# Altium project PCB_Project.PrjPcb
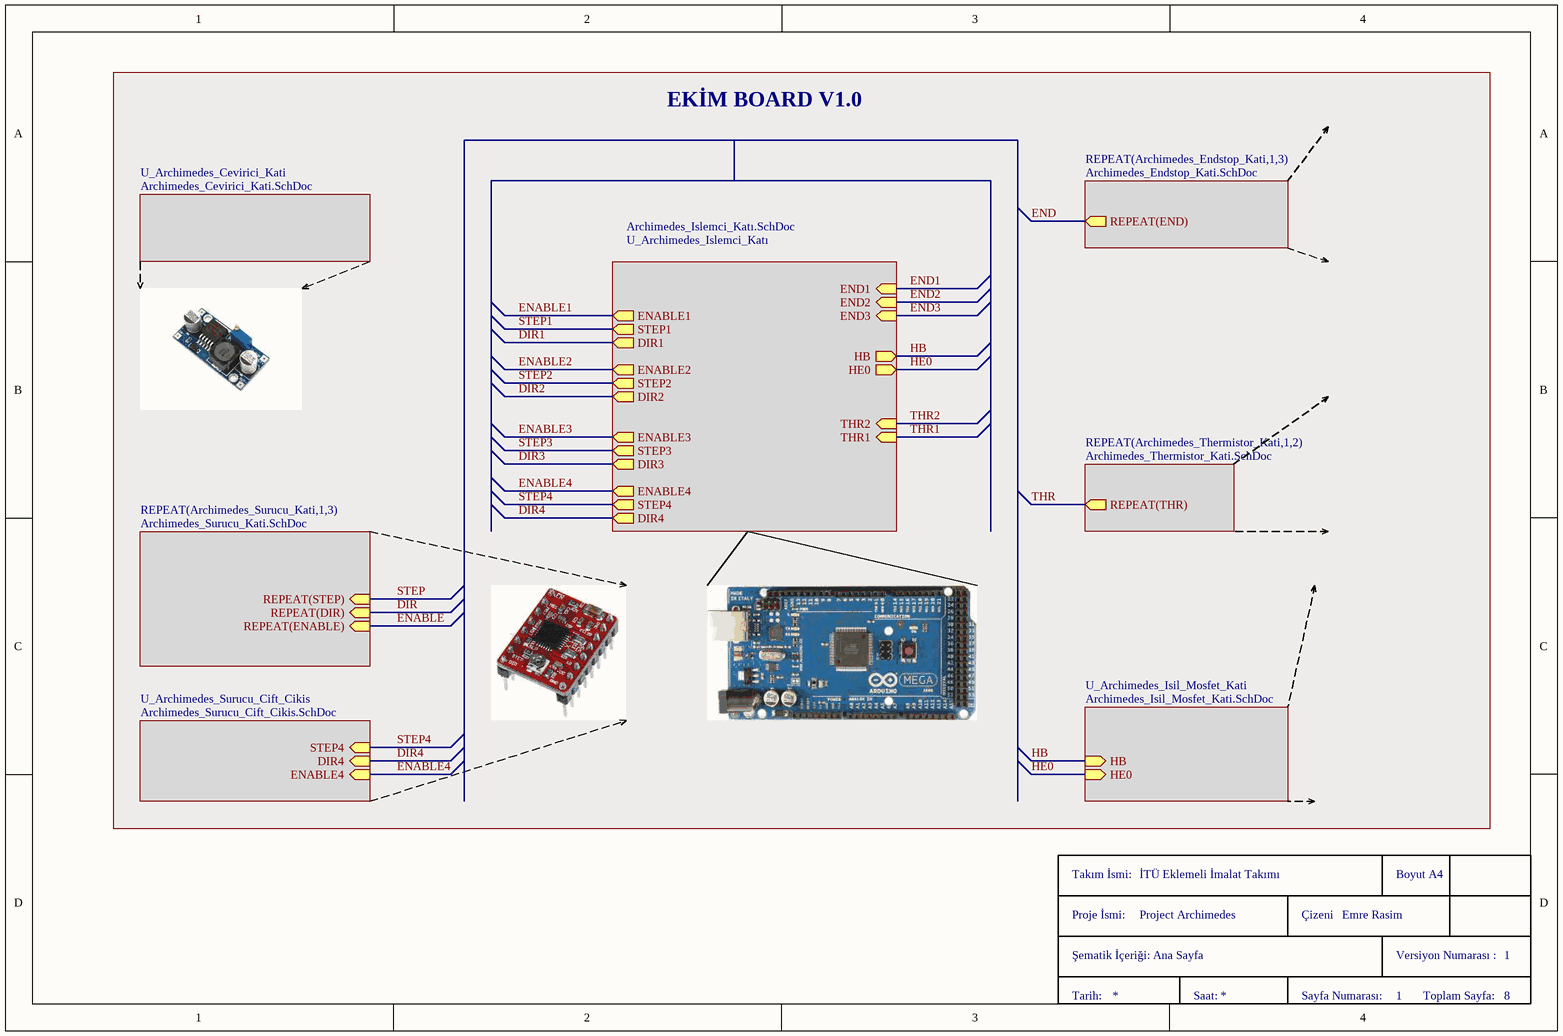
[diagram p0: Archimedes_Ana_Sayfa.SchDoc]
Cizeni: Emre Rasim; Projeismi: Project Archimedes; TakimIsmi: İTÜ Eklemeli İmalat Takımı; Versiyon: 1
8 sheets, 113 parts. Net scope: hierarchical (ports join the sheet entries above them; power ports are global).
Sheets:
  Archimedes_Ana_Sayfa.SchDoc
    U_Archimedes_Islemci_Katı = Archimedes_Islemci_Katı.SchDoc
    Archimedes_Surucu_Kati1 = Archimedes_Surucu_Kati.SchDoc
    Archimedes_Surucu_Kati2 = Archimedes_Surucu_Kati.SchDoc
    Archimedes_Surucu_Kati3 = Archimedes_Surucu_Kati.SchDoc
    Archimedes_Thermistor_Kati1 = Archimedes_Thermistor_Kati.SchDoc
    Archimedes_Thermistor_Kati2 = Archimedes_Thermistor_Kati.SchDoc
    U_Archimedes_Isil_Mosfet_Kati = Archimedes_Isil_Mosfet_Kati.SchDoc
    U_Archimedes_Cevirici_Kati = Archimedes_Cevirici_Kati.SchDoc
    Archimedes_Endstop_Kati1 = Archimedes_Endstop_Kati.SchDoc
    Archimedes_Endstop_Kati2 = Archimedes_Endstop_Kati.SchDoc
    Archimedes_Endstop_Kati3 = Archimedes_Endstop_Kati.SchDoc
    U_Archimedes_Surucu_Cift_Cikis = Archimedes_Surucu_Cift_Cikis.SchDoc

## Sheet Archimedes_Ana_Sayfa.SchDoc: Ana Sayfa
size A4; DrawnBy: Emre Rasim; DocumentNumber: 4; Revision: 1.0; SheetNumber: 1; SheetTotal: 8; Takimismi: İTÜ Eklemeli İmalat Takımı; Projeismi: Project Archimedes; Sematikicerigi: Ana Sayfa; Versiyon: 1; Cizeni: Emre Rasim

### Parts
(Parts that share a designator on the sheet are numbered #1, #2 ... from top to bottom, then left to right.)
TitleBlock-A4#1  TitleBlock-A4  (value not drawn)  (graphical)

### Sub-sheets
REPEAT(Archimedes_Endstop_Kati,1,3) = Archimedes_Endstop_Kati.SchDoc: REPEAT(END) (out)
REPEAT(Archimedes_Surucu_Kati,1,3) = Archimedes_Surucu_Kati.SchDoc: REPEAT(DIR) (in), REPEAT(STEP) (in), REPEAT(ENABLE) (in)
REPEAT(Archimedes_Thermistor_Kati,1,2) = Archimedes_Thermistor_Kati.SchDoc: REPEAT(THR) (out)
U_Archimedes_Cevirici_Kati = Archimedes_Cevirici_Kati.SchDoc: no entries
U_Archimedes_Isil_Mosfet_Kati = Archimedes_Isil_Mosfet_Kati.SchDoc: HB (in), HE0 (in)
U_Archimedes_Islemci_Katı = Archimedes_Islemci_Katı.SchDoc: ENABLE4 (out), STEP4 (out), DIR4 (out), ENABLE1 (out), STEP3 (out), DIR3 (out), END2 (in), END3 (in), END1 (in), HB (out), HE0 (out), THR2 (in), THR1 (in), ENABLE3 (out), DIR2 (out), STEP2 (out), ENABLE2 (out), DIR1 (out), STEP1 (out)
U_Archimedes_Surucu_Cift_Cikis = Archimedes_Surucu_Cift_Cikis.SchDoc: DIR4 (in), STEP4 (in), ENABLE4 (in)

### Nets
DIR: sheet REPEAT(Archimedes_Surucu_Kati,1,3)/REPEAT(DIR)
DIR4: sheet U_Archimedes_Islemci_Katı/DIR4, sheet U_Archimedes_Surucu_Cift_Cikis/DIR4
ENABLE: sheet REPEAT(Archimedes_Surucu_Kati,1,3)/REPEAT(ENABLE)
ENABLE4: sheet U_Archimedes_Islemci_Katı/ENABLE4, sheet U_Archimedes_Surucu_Cift_Cikis/ENABLE4
END: sheet REPEAT(Archimedes_Endstop_Kati,1,3)/REPEAT(END)
HB: sheet U_Archimedes_Islemci_Katı/HB, sheet U_Archimedes_Isil_Mosfet_Kati/HB
HE0: sheet U_Archimedes_Islemci_Katı/HE0, sheet U_Archimedes_Isil_Mosfet_Kati/HE0
STEP: sheet REPEAT(Archimedes_Surucu_Kati,1,3)/REPEAT(STEP)
STEP4: sheet U_Archimedes_Islemci_Katı/STEP4, sheet U_Archimedes_Surucu_Cift_Cikis/STEP4
THR: sheet REPEAT(Archimedes_Thermistor_Kati,1,2)/REPEAT(THR)

### Notes on the sheet
- EKİM BOARD V1.0
- (in symbol TitleBlock-A4) Takım İsmi:; Boyut A4; Proje İsmi:; Çizeni; Şematik İçeriği:; Versiyon Numarası :; Tarih:; Saat:; Sayfa Numarası:; Toplam Sayfa:

### Library data of the parts
TitleBlock-A4#1 = TitleBlock-A4: Title Block for İTU eklemeli imalat takımı

## Sheet Archimedes_Islemci_Katı.SchDoc: Kontrolcü Katı Tasarımı
size A4; DrawnBy: Emre Rasim; DocumentNumber: 8; Revision: 1.0; SheetNumber: 2; SheetTotal: 8; Sematikicerigi: Kontrolcü Katı Tasarımı
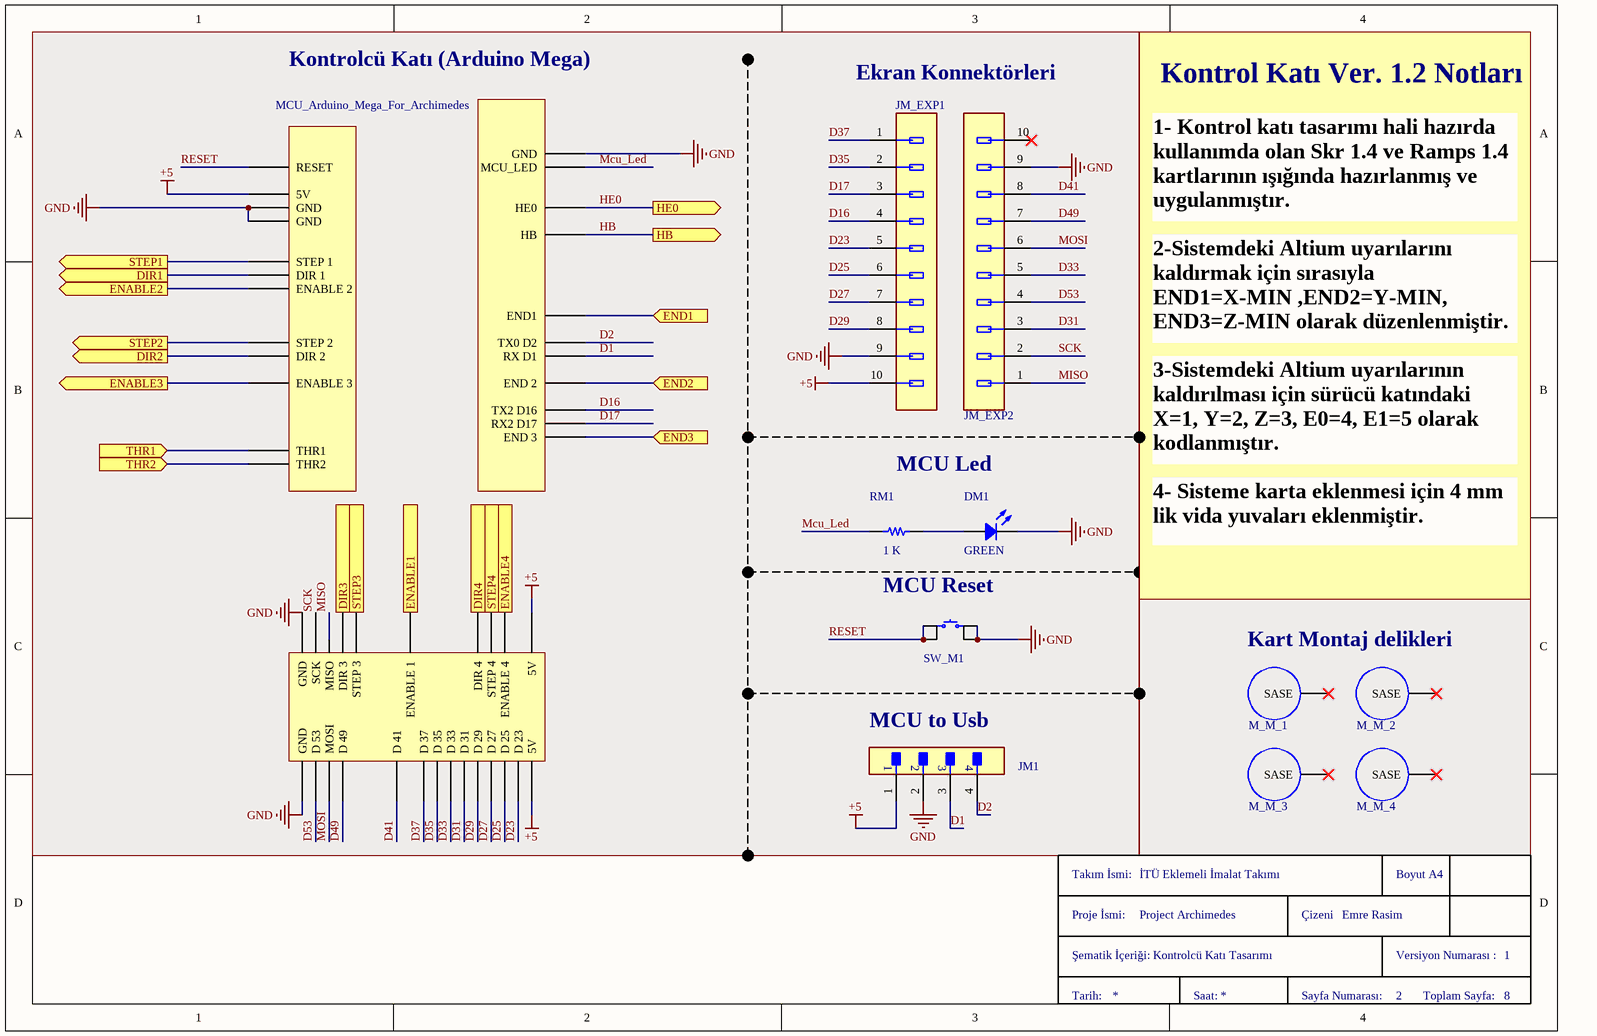
[diagram p1: Archimedes_Islemci_Katı.SchDoc]

### Parts
(Parts that share a designator on the sheet are numbered #1, #2 ... from top to bottom, then left to right.)
DM1  GREEN  [LED 0805/2012 GREEN]
JM1  2.5 mm locked  [CON_2.5MM_4_LEAD_180_LOCKED]  (value not drawn)
JM_EXP1  Con_2.54mm_10 lead_2 row_Ipc connector  [Con_10pin_2row_ıpc_connector]  (value not drawn)
JM_EXP2  Con_2.54mm_10 lead_2 row_Ipc connector  [Con_10pin_2row_ıpc_connector]  (value not drawn)
M_M_1  Vida  [Montaj4mm]  (value not drawn)
M_M_2  Vida  [Montaj4mm]  (value not drawn)
M_M_3  Vida  [Montaj4mm]  (value not drawn)
M_M_4  Vida  [Montaj4mm]  (value not drawn)
MCU_Arduino_Mega_For_Archimedes  Arduino Mega 2560  [MCU_Arduino_MEGA for Archimedes]  (value not drawn)
RM1  1 K  [RES 0805/2012]
SW_M1  Push button with 6x6 landmark  [SW_PUSH_6X6mm]  (value not drawn)
TitleBlock-A4#2  TitleBlock-A4  (value not drawn)  (graphical)

### Blocks framed on the sheet
Kart Montaj delikleri: M_M_1-M_M_4

### Ports
DIR1 (out), DIR2 (out), DIR3 (out), DIR4 (out), ENABLE1 (out), ENABLE2 (out), ENABLE3 (out), ENABLE4 (out), END1 (in), END2 (in), END3 (in), HB (out), HE0 (out), STEP1 (out), STEP2 (out), STEP3 (out), STEP4 (out), THR1 (in), THR2 (in)

### Nets
+5: JM1.1 JM_EXP1.10 MCU_Arduino_Mega_For_Archimedes.1(5V) MCU_Arduino_Mega_For_Archimedes.2(5V) MCU_Arduino_Mega_For_Archimedes.56(5V)
GND: DM1.2 JM1.2 JM_EXP1.9 JM_EXP2.9 MCU_Arduino_Mega_For_Archimedes.35(GND) MCU_Arduino_Mega_For_Archimedes.36(GND) MCU_Arduino_Mega_For_Archimedes.54(GND) MCU_Arduino_Mega_For_Archimedes.55(GND) MCU_Arduino_Mega_For_Archimedes.83(GND) SW_M1.3 SW_M1.4
D1: JM1.3 MCU_Arduino_Mega_For_Archimedes.69(RX_D1)
D2: JM1.4 MCU_Arduino_Mega_For_Archimedes.70(TX0_D2)
D16: JM_EXP1.4 MCU_Arduino_Mega_For_Archimedes.66(TX2_D16)
D17: JM_EXP1.3 MCU_Arduino_Mega_For_Archimedes.65(RX2_D17)
D23: JM_EXP1.5 MCU_Arduino_Mega_For_Archimedes.4(D_23)
D25: JM_EXP1.6 MCU_Arduino_Mega_For_Archimedes.6(D_25)
D27: JM_EXP1.7 MCU_Arduino_Mega_For_Archimedes.8(D_27)
D29: JM_EXP1.8 MCU_Arduino_Mega_For_Archimedes.10(D_29)
D31: JM_EXP2.3 MCU_Arduino_Mega_For_Archimedes.12(D_31)
D33: JM_EXP2.5 MCU_Arduino_Mega_For_Archimedes.14(D_33)
D35: JM_EXP1.2 MCU_Arduino_Mega_For_Archimedes.16(D_35)
D37: JM_EXP1.1 MCU_Arduino_Mega_For_Archimedes.18(D_37)
D41: JM_EXP2.8 MCU_Arduino_Mega_For_Archimedes.22(D_41)
D49: JM_EXP2.7 MCU_Arduino_Mega_For_Archimedes.30(D_49)
D53: JM_EXP2.4 MCU_Arduino_Mega_For_Archimedes.34(D_53)
DIR1: MCU_Arduino_Mega_For_Archimedes.51(DIR_1) ; port DIR1
DIR2: MCU_Arduino_Mega_For_Archimedes.45(DIR_2) ; port DIR2
DIR3: MCU_Arduino_Mega_For_Archimedes.29(DIR_3) ; port DIR3
DIR4: MCU_Arduino_Mega_For_Archimedes.9(DIR_4) ; port DIR4
ENABLE1: MCU_Arduino_Mega_For_Archimedes.19(ENABLE_1) ; port ENABLE1
ENABLE2: MCU_Arduino_Mega_For_Archimedes.50(ENABLE_2) ; port ENABLE2
ENABLE3: MCU_Arduino_Mega_For_Archimedes.44(ENABLE_3) ; port ENABLE3
ENABLE4: MCU_Arduino_Mega_For_Archimedes.5(ENABLE_4) ; port ENABLE4
END1: MCU_Arduino_Mega_For_Archimedes.72(END1) ; port END1
END2: MCU_Arduino_Mega_For_Archimedes.68(END_2) ; port END2
END3: MCU_Arduino_Mega_For_Archimedes.64(END_3) ; port END3
HB: MCU_Arduino_Mega_For_Archimedes.77(HB) ; port HB
HE0: MCU_Arduino_Mega_For_Archimedes.79(HE0) ; port HE0
Mcu_Led: MCU_Arduino_Mega_For_Archimedes.82(MCU_LED) RM1.1
MISO: JM_EXP2.1 MCU_Arduino_Mega_For_Archimedes.31(MISO)
MOSI: JM_EXP2.6 MCU_Arduino_Mega_For_Archimedes.32(MOSI)
RESET: MCU_Arduino_Mega_For_Archimedes.58(RESET) SW_M1.1 SW_M1.2
SCK: JM_EXP2.2 MCU_Arduino_Mega_For_Archimedes.33(SCK)
STEP1: MCU_Arduino_Mega_For_Archimedes.52(STEP_1) ; port STEP1
STEP2: MCU_Arduino_Mega_For_Archimedes.46(STEP_2) ; port STEP2
STEP3: MCU_Arduino_Mega_For_Archimedes.27(STEP_3) ; port STEP3
STEP4: MCU_Arduino_Mega_For_Archimedes.7(STEP_4) ; port STEP4
THR1: MCU_Arduino_Mega_For_Archimedes.39(THR1) ; port THR1
THR2: MCU_Arduino_Mega_For_Archimedes.38(THR2) ; port THR2
NetDM1_1: DM1.1 RM1.2

Not connected (* = marked no-connect by the designer): JM_EXP2 10*; M_M_1 1(SASE)*; M_M_2 1(SASE)*; M_M_3 1(SASE)*; M_M_4 1(SASE)*

### Notes on the sheet
- Kontrolcü Katı (Arduino Mega)
- Ekran Konnektörleri
- Kontrol Katı Ver. 1.2 Notları
- 1- Kontrol katı tasarımı hali hazırda kullanımda olan Skr 1.4 ve Ramps 1.4 kartlarının ışığında hazırlanmış ve uygulanmıştır.
- 2-Sistemdeki Altium uyarılarını kaldırmak için sırasıyla END1=X-MIN ,END2=Y-MIN, END3=Z-MIN olarak düzenlenmiştir.
- MCU Led
- 3-Sistemdeki Altium uyarılarının kaldırılması için sürücü katındaki X=1, Y=2, Z=3, E0=4, E1=5 olarak kodlanmıştır.
- 4- Sisteme karta eklenmesi için 4 mm lik vida yuvaları eklenmiştir.
- MCU Reset
- (near JM1) MCU to Usb
- (in symbol TitleBlock-A4) Takım İsmi:; Boyut A4; Proje İsmi:; Çizeni; Şematik İçeriği:; Versiyon Numarası :; Tarih:; Saat:; Sayfa Numarası:; Toplam Sayfa:

### Library data of the parts
DM1 = LED 805
JM1 = Con_2.5mm_4_lead_180_locked: 2.5 mm 4 lead locked connector
JM_EXP1 JM_EXP2 = Con_2.54mm_10 lead_2 row_Ipc connector: CONN 10 Positions Header Connector 0.100" (2.54mm) Through Hole Gold; Manufacturer: Molex; Part Number: 70246-1001; Voltage: 250V; Current - Maximum per Contact: 2.5A; Number of Circuits: 10; helpURL: https://upverter.com/upn/revision/723849a355ae3f31/; ComponentLink2Description: Datasheet; Temperature: -55°C to +120°C; Package: HDR10; Supplier 2: Mouser; Supplier 1: Digi-Key; ComponentLink1URL: https://upverter.com/upn/revision/723849a355ae3f31/; Supplier Part Number 2: 538-70246-1001; Supplier Part Number 1: WM9219-ND; ComponentLink1Description: Upverter; ComponentLink2URL: http://www.molex.com/pdm_docs/sd/702461001_sd.pdf; RoHS: TRUE; Mouser Part Number: 538-70246-1001; Temperature Range High: +120°C; Digikey Description: CONN 10 Positions Header Connector 0.100" (2.54mm) Through Hole Gold; Digikey Part Number: WM9219-ND; Lead Free: yes; Temperature Range Low: -55°C; Pitch: 2.54mm
M_M_1-M_M_4 = Montaj Deliği 4mm
MCU_Arduino_Mega_For_Archimedes = MCU_Arduino_Mega_For_Archimedes
RM1 = Resistor 805
SW_M1 = SW_PUSH_6X6mm
TitleBlock-A4#2 = TitleBlock-A4: as TitleBlock-A4#1 on sheet Archimedes_Ana_Sayfa

## Sheet Archimedes_Surucu_Kati.SchDoc: Step Motor Sürücü Katı Tasarımı
size A4; DrawnBy: Emre Rasim; DocumentNumber: 6; Revision: 1.0; SheetNumber: 3; SheetTotal: 7; Sematikicerigi: Step Motor Sürücü Katı Tasarımı
Used 3 times, as channels Archimedes_Surucu_Kati1, Archimedes_Surucu_Kati2, Archimedes_Surucu_Kati3. Parts and nets are listed once, with the designators drawn on the sheet.
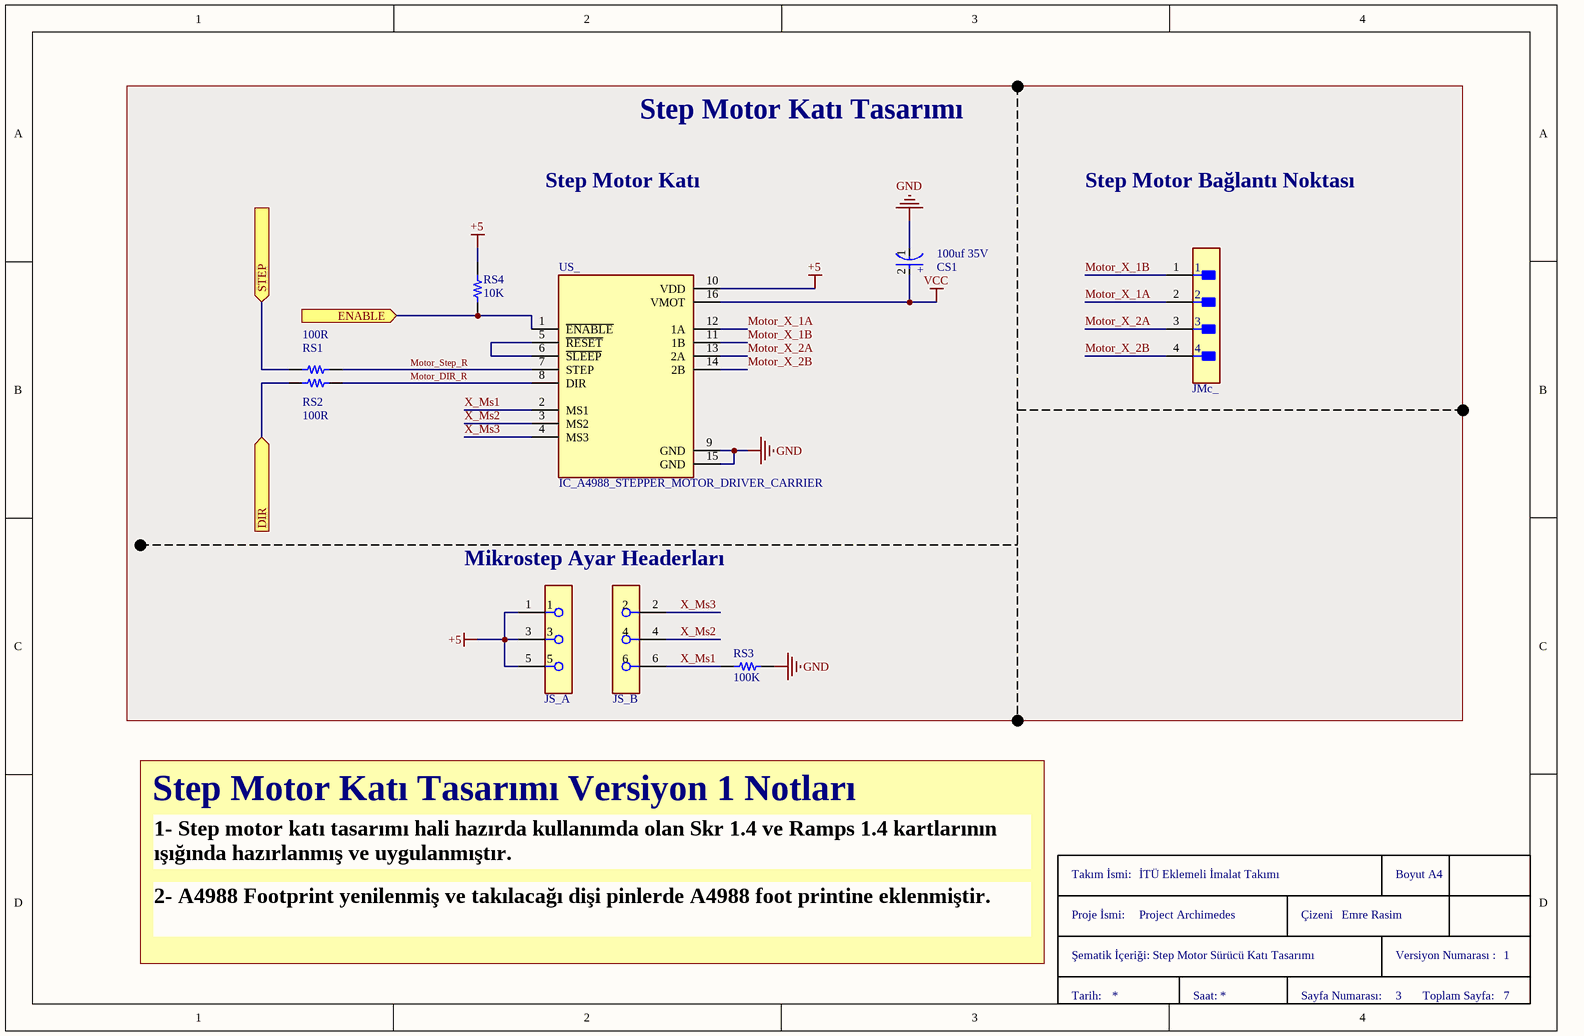
[diagram p2: Archimedes_Surucu_Kati.SchDoc]

### Parts
CS1  100uf 35V  [C_Smd_D6.3_H_7.7_Electrolytic_Cap]
JMc_  2.5 mm locked  [CON_2.5MM_4_LEAD_180_LOCKED]  (value not drawn)
JS_  Con_3*2_Male_Header  [Con_3*2_Male_header]  (value not drawn)  (parts A,B of 2)
RS1  100R  [RES 0805/2012]
RS2  100R  [RES 0805/2012]
RS3  100K  [RES 0805/2012]
RS4  10K  [RES 0805/2012]
TitleBlock-A4  TitleBlock-A4  (value not drawn)  (graphical)
US_  IC_A4988_STEPPER_MOTOR_DRIVER_CARRIER  [IC_A4988_STEPPER_MOTOR_DRIVER_CARRIER]

### Blocks framed on the sheet
Step Motor Katı Tasarımı: CS1 JMc_ JS_ RS1-RS4 US_

### Ports
DIR (in), ENABLE (in), STEP (in)

### Nets
+5: JS_.1 JS_.3 JS_.5 RS4.2 US_.10(VDD)
GND: CS1.1(C) RS3.2 US_.9(GND) US_.15(GND)
VCC: CS1.2(A) US_.16(VMOT)
DIR: RS2.1 ; port DIR
ENABLE: RS4.1 US_.1(~{ENABLE}) ; port ENABLE
Motor_DIR_R: RS2.2 US_.8(DIR)
Motor_Step_R: RS1.2 US_.7(STEP)
Motor_X_1A: JMc_.2 US_.12(1A)
Motor_X_1B: JMc_.1 US_.11(1B)
Motor_X_2A: JMc_.3 US_.13(2A)
Motor_X_2B: JMc_.4 US_.14(2B)
STEP: RS1.1 ; port STEP
X_Ms1: JS_.6 RS3.1 US_.2(MS1)
X_Ms2: JS_.4 US_.3(MS2)
X_Ms3: JS_.2 US_.4(MS3)
NetUS__5: US_.5(~{RESET}) US_.6(~{SLEEP})

### Channels
Archimedes_Surucu_Kati1: designators CS1=CS1A JMc_=JMc_A JS_=JS_A RS1=RS1A RS2=RS2A RS3=RS3A RS4=RS4A TitleBlock-A4=TitleBlock-A4A#1 US_=US_A; ports DIR=DIR1 ENABLE=ENABLE1 STEP=STEP1
Archimedes_Surucu_Kati2: designators CS1=CS1B JMc_=JMc_B JS_=JS_B RS1=RS1B RS2=RS2B RS3=RS3B RS4=RS4B TitleBlock-A4=TitleBlock-A4B#1 US_=US_B; ports DIR=DIR2 ENABLE=ENABLE2 STEP=STEP2
Archimedes_Surucu_Kati3: designators CS1=CS1C JMc_=JMc_C JS_=JS_C RS1=RS1C RS2=RS2C RS3=RS3C RS4=RS4C TitleBlock-A4=TitleBlock-A4C#1 US_=US_C; ports DIR=DIR3 ENABLE=ENABLE3 STEP=STEP3

### Notes on the sheet
- Step Motor Katı
- Step Motor Bağlantı Noktası
- (near JS_) Mikrostep Ayar Headerları
- Step Motor Katı Tasarımı Versiyon 1 Notları
- 1- Step motor katı tasarımı hali hazırda kullanımda olan Skr 1.4 ve Ramps 1.4 kartlarının ışığında hazırlanmış ve uygulanmıştır.
- 2- A4988 Footprint yenilenmiş ve takılacağı dişi pinlerde A4988 foot printine eklenmiştir.
- (in symbol C_smd_D6.3_H7.7) +
- (in symbol TitleBlock-A4) Takım İsmi:; Boyut A4; Proje İsmi:; Çizeni; Şematik İçeriği:; Versiyon Numarası :; Tarih:; Saat:; Sayfa Numarası:; Toplam Sayfa:

### Library data of the parts
CS1 = C_smd_D6.3_H7.7: electrolytic capacitor with 100 uf and 35 volt rating
JMc_ = Con_2.5mm_4_lead_180_locked: 2.5 mm 4 lead locked connector
JS_ = Con_3*2_Male_Header: 3*2 male header
RS1 RS2 = Resistor 805: 100 R ohm Resistor  with 805 pack and %1 tolerance rating
RS3 = Resistor 805: 100 K ohm Resistor  with 805 pack and %1 tolerance rating
RS4 = Resistor 805: 10 K ohm Resistor  with 805 pack and %1 tolerance rating
TitleBlock-A4 = TitleBlock-A4: as TitleBlock-A4#1 on sheet Archimedes_Ana_Sayfa
US_ = IC_A4988_STEPPER_MOTOR_DRIVER_CARRIER: Stepper motor controler; IC: A4988; 1A; Uin mot: 8Ã·35V; Package: None; Availability: Unavailable; Value: *; MP: A4988_STEPPER_MOTOR_DRIVER_CARRIER; Price: None

## Sheet Archimedes_Thermistor_Kati.SchDoc: Thermistör Katı Tasarımı
size A4; DrawnBy: Emre Rasim; DocumentNumber: 5; Revision: 1.0; SheetNumber: 7; SheetTotal: 7; Sematikicerigi: Thermistör Katı Tasarımı
Used 2 times, as channels Archimedes_Thermistor_Kati1, Archimedes_Thermistor_Kati2. Parts and nets are listed once, with the designators drawn on the sheet.
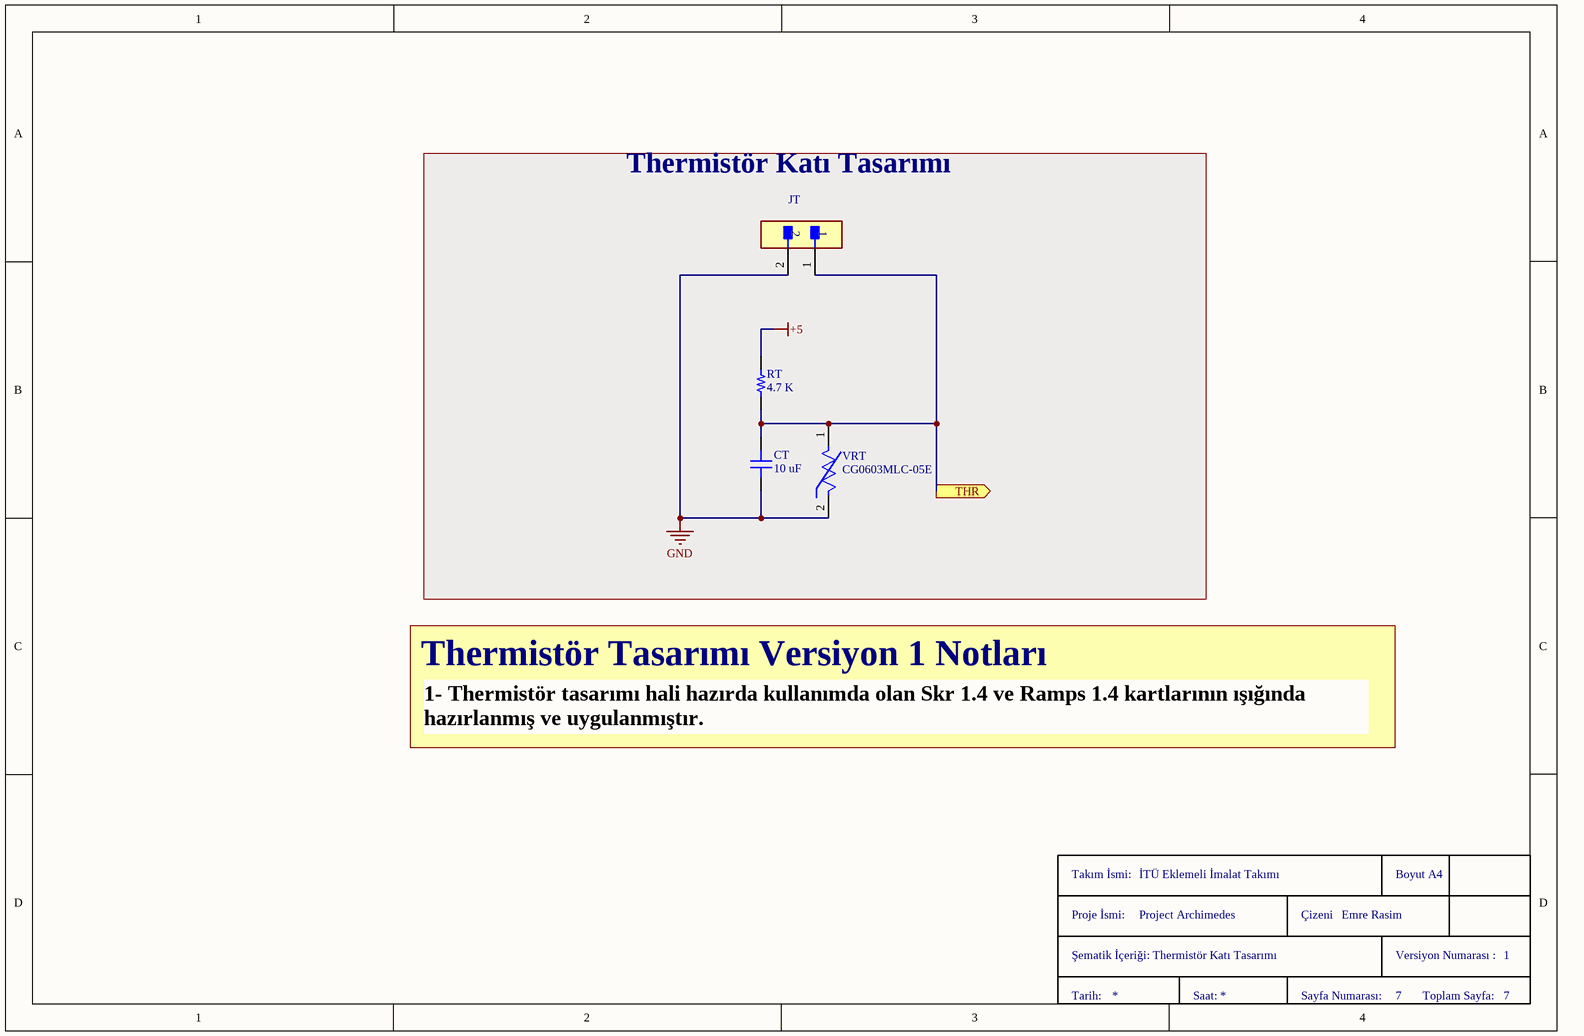
[diagram p3: Archimedes_Thermistor_Kati.SchDoc]

### Parts
CT  10 uF  [CAP 1206/3216]
JT  Con_2.5mm_2 lead_Female locked connector for 3d printer  [Con_2lead_2.5mm_3d_printer]  (value not drawn)
RT  4.7 K  [RES 0805/2012]
TitleBlock-A4  TitleBlock-A4  (value not drawn)  (graphical)
VRT  CG0603MLC-05E  [VR_Varistor_0603_CG0603MLC-05E]

### Blocks framed on the sheet
Thermistör Katı Tasarımı: CT JT RT VRT

### Ports
THR (out)

### Nets
+5: RT.2
GND: CT.1 JT.2 VRT.2
THR: CT.2 JT.1 RT.1 VRT.1 ; port THR

### Channels
Archimedes_Thermistor_Kati1: designators CT=CTA JT=JTA RT=RTA TitleBlock-A4=TitleBlock-A4A#2 VRT=VRTA; ports THR=THR1
Archimedes_Thermistor_Kati2: designators CT=CTB JT=JTB RT=RTB TitleBlock-A4=TitleBlock-A4B#2 VRT=VRTB; ports THR=THR2

### Notes on the sheet
- Thermistör Tasarımı Versiyon 1 Notları
- 1- Thermistör tasarımı hali hazırda kullanımda olan Skr 1.4 ve Ramps 1.4 kartlarının ışığında hazırlanmış ve uygulanmıştır.
- (in symbol TitleBlock-A4) Takım İsmi:; Boyut A4; Proje İsmi:; Çizeni; Şematik İçeriği:; Versiyon Numarası :; Tarih:; Saat:; Sayfa Numarası:; Toplam Sayfa:

### Library data of the parts
CT = Capacitor 1206: 10 uF  and 50 Volt Ceramic Capacitor 1206 pack with X5R rating
RT = Resistor 805: 4.7 K ohm Resistor  with 805 pack and %1 tolerance rating
TitleBlock-A4 = TitleBlock-A4: as TitleBlock-A4#1 on sheet Archimedes_Ana_Sayfa
VRT = VR_0603_CG0603MLC-05E: Varistor with 5v voltage and 0603 package - CG0603MLC-05E

## Sheet Archimedes_Isil_Mosfet_Kati.SchDoc: Isıl - Mosfet Sürücü Katı Tasarımı
size A4; DrawnBy: Emre Rasim; DocumentNumber: 7; Revision: 1.1; SheetNumber: 4; SheetTotal: 8; Sematikicerigi: Isıl - Mosfet Sürücü Katı Tasarımı
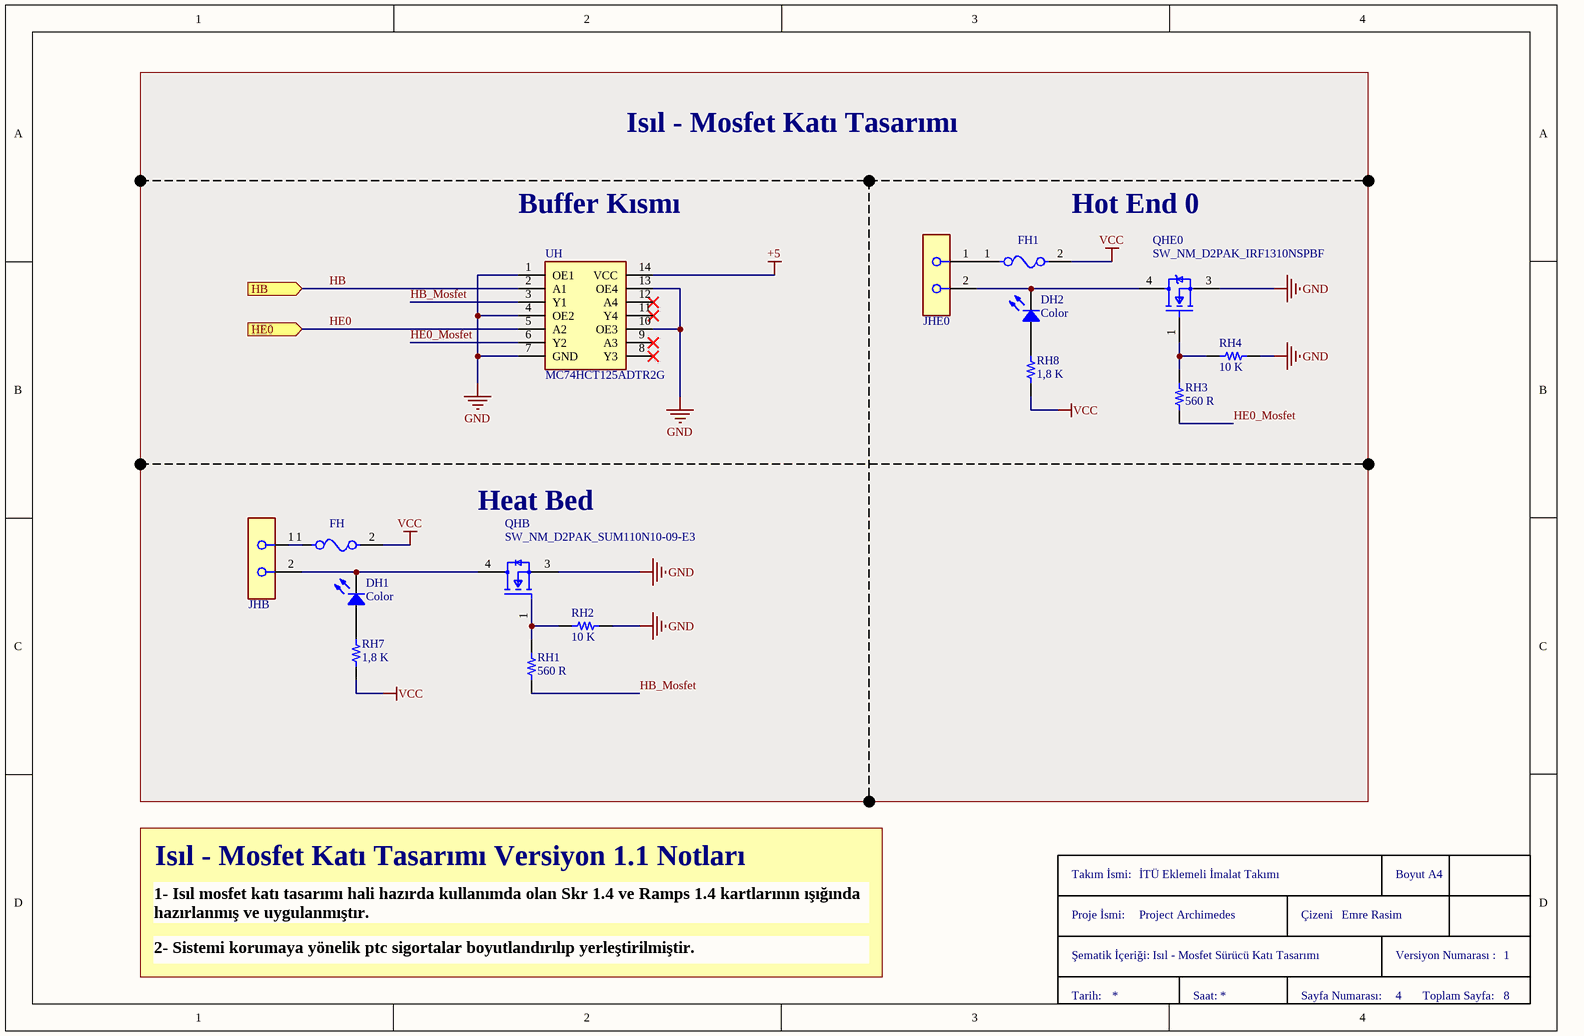
[diagram p4: Archimedes_Isil_Mosfet_Kati.SchDoc]

### Parts
(Parts that share a designator on the sheet are numbered #1, #2 ... from top to bottom, then left to right.)
DH1  Color  [LED 0805/2012 GREEN]
DH2  Color  [LED 0805/2012 GREEN]
FH  VR_PTC_FRU900-30F  [VR_PTC_FRU900-30F]  (value not drawn)
FH1  VR_PTC_FRU300-30F  [VR_PTC_FRU300-30F]  (value not drawn)
JHB  Con_5mm_2 lead  [Con_5mm_2lead]  (value not drawn)
JHE0  Con_5mm_2 lead  [Con_5mm_2lead]  (value not drawn)
QHB  SW_NM_D2PAK_SUM110N10-09-E3  [SW_D2PAK_Vishay_SUM110N10-09]
QHE0  SW_NM_D2PAK_IRF1310NSPBF  [SW_D2PAK_NMOS_IOR_IRF1310NSTRLPBF]
RH1  560 R  [RES 0805/2012]
RH2  10 K  [RES 0805/2012]
RH3  560 R  [RES 0805/2012]
RH4  10 K  [RES 0805/2012]
RH7  1,8 K  [RES 0805/2012]
RH8  1,8 K  [RES 0805/2012]
TitleBlock-A4#3  TitleBlock-A4  (value not drawn)  (graphical)
UH  MC74HCT125ADTR2G  [IC_Tssop14_MC74HCT125ADTR2G]

### Ports
HB (in), HE0 (in)

### Nets
+5: UH.14(VCC)
GND: QHB.3(S) QHE0.3(S) RH2.1 RH4.1 UH.1(OE1) UH.4(OE2) UH.7(GND) UH.10(OE3) UH.13(OE4)
VCC: FH.2 FH1.2 RH7.2 RH8.2
HB: UH.2(A1) ; port HB
HB_Mosfet: RH1.1 UH.3(Y1)
HE0: UH.5(A2) ; port HE0
HE0_Mosfet: RH3.1 UH.6(Y2)
NetDH1_1: DH1.1 RH7.1
NetDH1_2: DH1.2 JHB.2 QHB.4(D)
NetDH2_1: DH2.1 RH8.1
NetDH2_2: DH2.2 JHE0.2 QHE0.4(D)
NetFH1_1: FH1.1 JHE0.1
NetFH_1: FH.1 JHB.1
NetQHB_1: QHB.1(G) RH1.2 RH2.2
NetQHE0_1: QHE0.1(G) RH3.2 RH4.2

Not connected (* = marked no-connect by the designer): UH 8(Y3)* 9(A3)* 11(Y4)* 12(A4)*

### Notes on the sheet
- Isıl - Mosfet Katı Tasarımı
- Buffer Kısmı
- Hot End 0
- Heat Bed
- Isıl - Mosfet Katı Tasarımı Versiyon 1.1 Notları
- 1- Isıl mosfet katı tasarımı hali hazırda kullanımda olan Skr 1.4 ve Ramps 1.4 kartlarının ışığında hazırlanmış ve uygulanmıştır.
- 2- Sistemi korumaya yönelik ptc sigortalar boyutlandırılıp yerleştirilmiştir.
- (in symbol TitleBlock-A4) Takım İsmi:; Boyut A4; Proje İsmi:; Çizeni; Şematik İçeriği:; Versiyon Numarası :; Tarih:; Saat:; Sayfa Numarası:; Toplam Sayfa:

### Library data of the parts
DH1 DH2 = LED 805
FH = VR_PTC_FRU900-30F: Ptc Fuse with 9 Amper hold and 18 Amper trip values
FH1 = VR_PTC_FRU300-30F: Ptc Fuse with 3 Amper hold and 6 Amper Trip values
JHB JHE0 = Con_5mm_2 lead: TERM BLOCK 2POS SIDE ENTRY 5MM
QHB = SW_NM_D2PAK_SUM110N10-09-E3: Vishay SUM110N10 nmos with d2pak package , 100 volt and 110 amper values
QHE0 = SW_NM_D2PAK_IRF1310NSPBF: IOR IRF1310NSPBF NMOS with 100 volt and 42 amper ratings
RH1 RH3 = Resistor 805: 560 R ohm Resistor  with 805 pack and %1 tolerance rating
RH2 RH4 = Resistor 805: as RS4 on sheet Archimedes_Surucu_Kati
RH7 = Resistor 805: 1,8 K ohm Resistor  with 805 pack and %1 tolerance rating
RH8 = Resistor 805: 1,8 K K ohm Resistor  with 805 pack and %1 tolerance rating
TitleBlock-A4#3 = TitleBlock-A4: as TitleBlock-A4#1 on sheet Archimedes_Ana_Sayfa
UH = IC_MC74HCT125ADTR2G: ON SEMICONDUCTOR - MC74HCT125ADTR2G - Buffer, Non Inverting, 74HCT125A, 2 V to 6 V, TSSOP-14; Manufacturer_Name: onsemi; Geometry.Height: 1.2mm; Manufacturer_Part_Number: MC74HCT125ADTR2G; Mouser Part Number: 863-MC74HCT125ADTR2G; Mouser Price/Stock: https://www.mouser.co.uk/ProductDetail/onsemi/MC74HCT125ADTR2G?qs=mB5q98eOMcZnEC08OY8tTw%3D%3D; Arrow Part Number: MC74HCT125ADTR2G; Arrow Price/Stock: https://www.arrow.com/en/products/mc74hct125adtr2g/on-semiconductor; Datasheet Link: https://www.arrow.com/en/products/mc74hct125adtr2g/on-semiconductor

## Sheet Archimedes_Cevirici_Kati.SchDoc: 5V Sağlanmasına Yönelik Alçaltıcı Çevirici Tasarımı
size A4; ApprovedBy: Emre Rasim; DrawnBy: Emre Rasim; DocumentNumber: 2; Revision: 1.3; SheetNumber: 5; SheetTotal: 8; Sematikicerigi: 5V Sağlanmasına Yönelik Alçaltıcı Tasarımı; Versiyon: 1.3
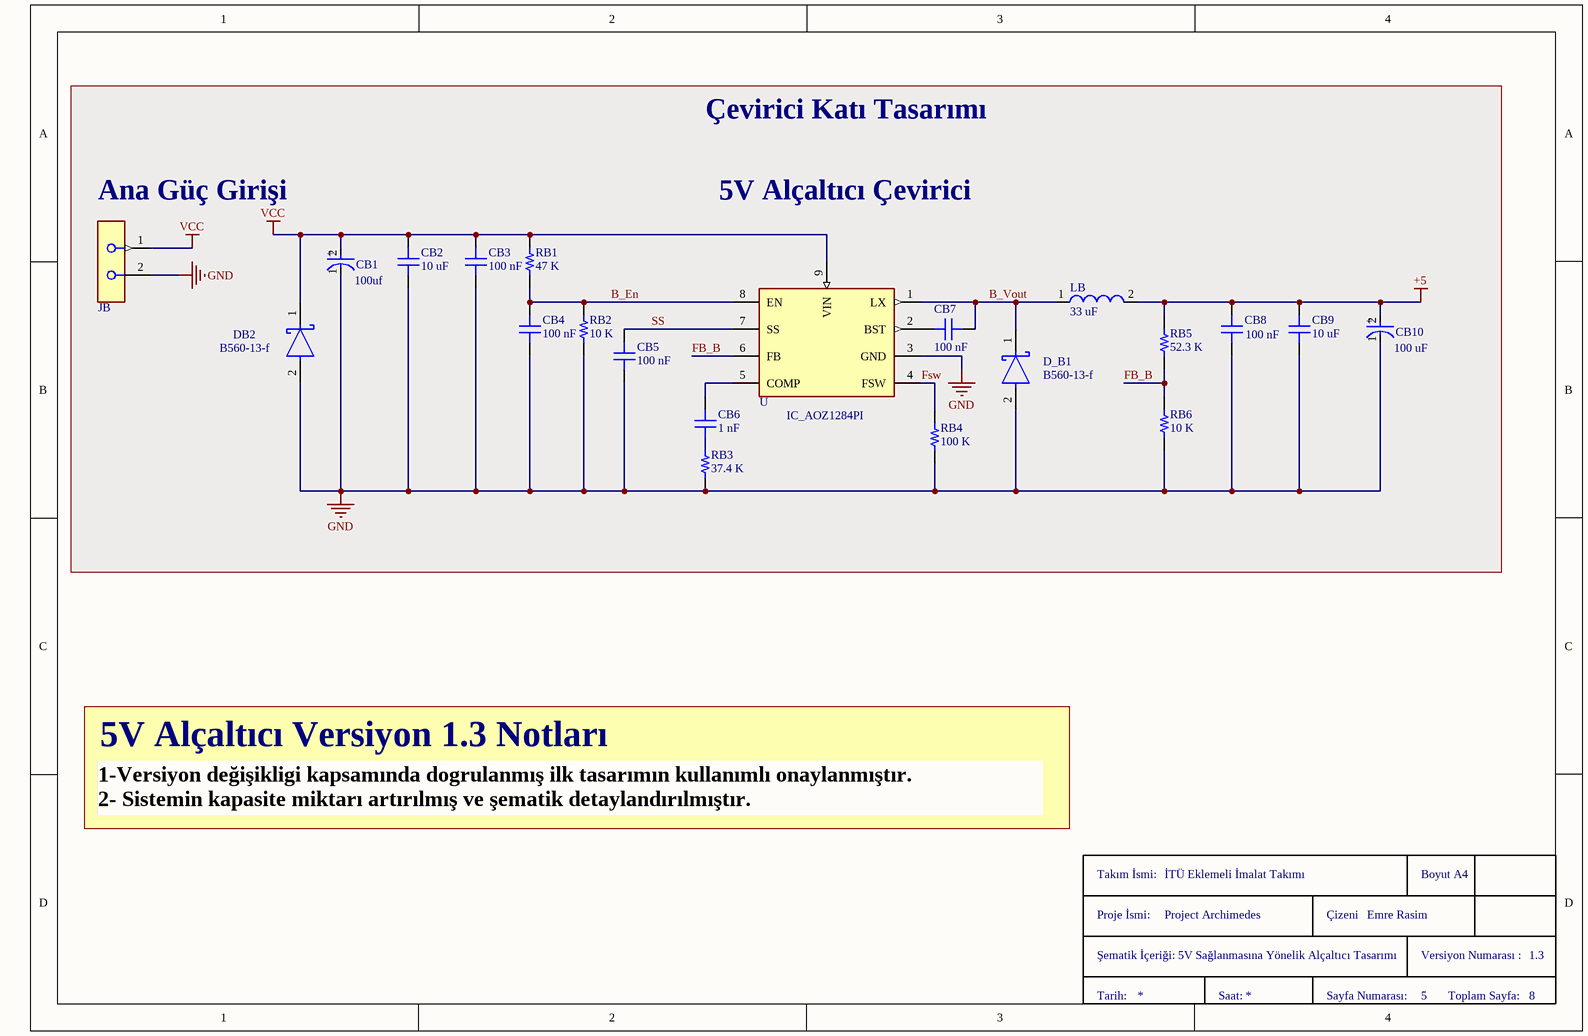
[diagram p5: Archimedes_Cevirici_Kati.SchDoc]

### Parts
(Parts that share a designator on the sheet are numbered #1, #2 ... from top to bottom, then left to right.)
CB1  100uf  [C_Smd_D6.3_H_7.7_Electrolytic_Cap]
CB2  10 uF  [CAP 1206/3216]
CB3  100 nF  [CAP 0805/2012]
CB4  100 nF  [CAP 0805/2012]
CB5  100 nF  [CAP 0805/2012]
CB6  1 nF  [CAP 0805/2012]
CB7  100 nF  [CAP 0805/2012]
CB8  100 nF  [CAP 0805/2012]
CB9  10 uF  [CAP 1206/3216]
CB10  100 uF  [C_Smd_D6.3_H_7.7_Electrolytic_Cap]
D_B1  B560-13-f  [D_DO214AB_B560C-13-F]
DB2  B560-13-f  [D_DO214AB_B560C-13-F]
JB  Con_5mm_2 lead  [Con_5mm_2lead]  (value not drawn)
LB  33 uF  [L_12*12_33uh_İnductor]
RB1  47 K  [RES 0805/2012]
RB2  10 K  [RES 0805/2012]
RB3  37.4 K  [RES 0805/2012]
RB4  100 K  [RES 0805/2012]
RB5  52.3 K  [RES 0805/2012]
RB6  10 K  [RES 0805/2012]
TitleBlock-A4#4  TitleBlock-A4  (value not drawn)  (graphical)
U  IC_AOZ1284PI  [IC_AOZ1284_SOP127P]

### Nets
+5: CB8.2 CB9.1 CB10.2(A) LB.2 RB5.2
GND: CB1.1(C) CB2.2 CB3.1 CB4.1 CB5.1 CB8.1 CB9.2 CB10.1(C) D_B1.2(A) DB2.2(A) JB.2 RB2.1 RB3.1 RB4.1 RB6.1 U.3(GND)
VCC: CB1.2(A) CB2.1 CB3.2 DB2.1(C) JB.1 RB1.2 U.9(VIN)
B_En: CB4.2 RB1.1 RB2.2 U.8(EN)
B_Vout: CB7.1 D_B1.1(C) LB.1 U.1(LX)
FB_B: RB5.1 RB6.2 U.6(FB)
Fsw: RB4.2 U.4(FSW)
SS: CB5.2 U.7(SS)
NetCB6_1: CB6.1 RB3.2
NetCB6_2: CB6.2 U.5(COMP)
NetCB7_2: CB7.2 U.2(BST)

### Notes on the sheet
- Çevirici Katı Tasarımı
- Ana Güç Girişi
- 5V Alçaltıcı Çevirici
- 5V Alçaltıcı Versiyon 1.3 Notları
- 1-Versiyon değişikligi kapsamında dogrulanmış ilk tasarımın kullanımlı onaylanmıştır.                          2- Sistemin kapasite miktarı artırılmış ve şematik detaylandırılmıştır.
- (in symbol C_smd_D6.3_H7.7) +
- (in symbol TitleBlock-A4) Takım İsmi:; Boyut A4; Proje İsmi:; Çizeni; Şematik İçeriği:; Versiyon Numarası :; Tarih:; Saat:; Sayfa Numarası:; Toplam Sayfa:

### Library data of the parts
CB1 CB10 = C_smd_D6.3_H7.7: Electrolytic capacitor with 100 uf and 35 volt rating
CB2 = Capacitor 1206: as CT on sheet Archimedes_Thermistor_Kati
CB3 CB4 CB7 CB8 = Capacitor 805: 100 nF  and 50 Volt Ceramic Capacitor 805 pack with X7R rating
CB5 = Capacitor 805: 100 nF and 50 Volt Ceramic Capacitor 805 pack with X7R rating
CB6 = Capacitor 805: 1 nF and 50 Volt Ceramic Capacitor 805 pack with X7R rating
CB9 = Capacitor 1206: 10 uF  and 50 V Ceramic Capacitor 1206 pack with X5R rating
D_B1 DB2 = D_Do214AB_B560-13-F: Schottky diode with 5A and 60 Volt rating
JB = Con_5mm_2 lead: TERM BLOCK 2POS SIDE ENTRY 5MM
LB = L_12_12_33uh_smd_inductor: SMD Flat Wire High Current Inductor WE-HCI, L=33.0 µH; PartNumber: 74435573300; Inductance: 33.0 ÂµH; ComponentLink1Description: Manufacturer Link; ComponentLink2Description: Datasheet; DatasheetVersion: ver 2, Nov-2009; ComponentLink1URL: http://www.we-online.com; PackageVersion: 2009; PackageDescription: Inductor, 2-Leads, Body 18.3 x 18.2 mm; ComponentLink2URL: http://www.we-online.de/katalog/media/pdf/74435573300.pdf; PackageReference: WE-HCI-1890
RB1 = Resistor 805: 47 K ohm Resistor  with 805 pack and %1 tolerance rating
RB2 RB6 = Resistor 805: as RS4 on sheet Archimedes_Surucu_Kati
RB3 = Resistor 805: 37,4 K ohm Resistor  with 805 pack and %1 tolerance rating
RB4 = Resistor 805: as RS3 on sheet Archimedes_Surucu_Kati
RB5 = Resistor 805: 52,3 K ohm Resistor  with 805 pack and %1 tolerance rating
TitleBlock-A4#4 = TitleBlock-A4: as TitleBlock-A4#1 on sheet Archimedes_Ana_Sayfa
U = IC_AOZ1284PI: Buck Switching Regulator IC Positive Adjustable 0.8V 1 Output 4A 8-SOIC _0.154, 3.90mm Width_ Exposed Pad; MF: Alpha &; Price: None; Availability: Unavailable; Package: SO-8 Alpha &amp; Omega Semiconductor; SnapEDA_Link: https://www.snapeda.com/parts/AOZ1284PI/Alpha%20%26%20Omega%20Semiconductor%20Inc./view-part/473739/?ref=snap; MP: AOZ1284PI; Value: *

## Sheet Archimedes_Endstop_Kati.SchDoc: End Stop Katı Tasarımı
size A4; DrawnBy: Emre Rasim; DocumentNumber: 3; Revision: 1.0; SheetNumber: 6; SheetTotal: 7; Sematikicerigi: End Stop Katı Tasarımı
Used 3 times, as channels Archimedes_Endstop_Kati1, Archimedes_Endstop_Kati2, Archimedes_Endstop_Kati3. Parts and nets are listed once, with the designators drawn on the sheet.
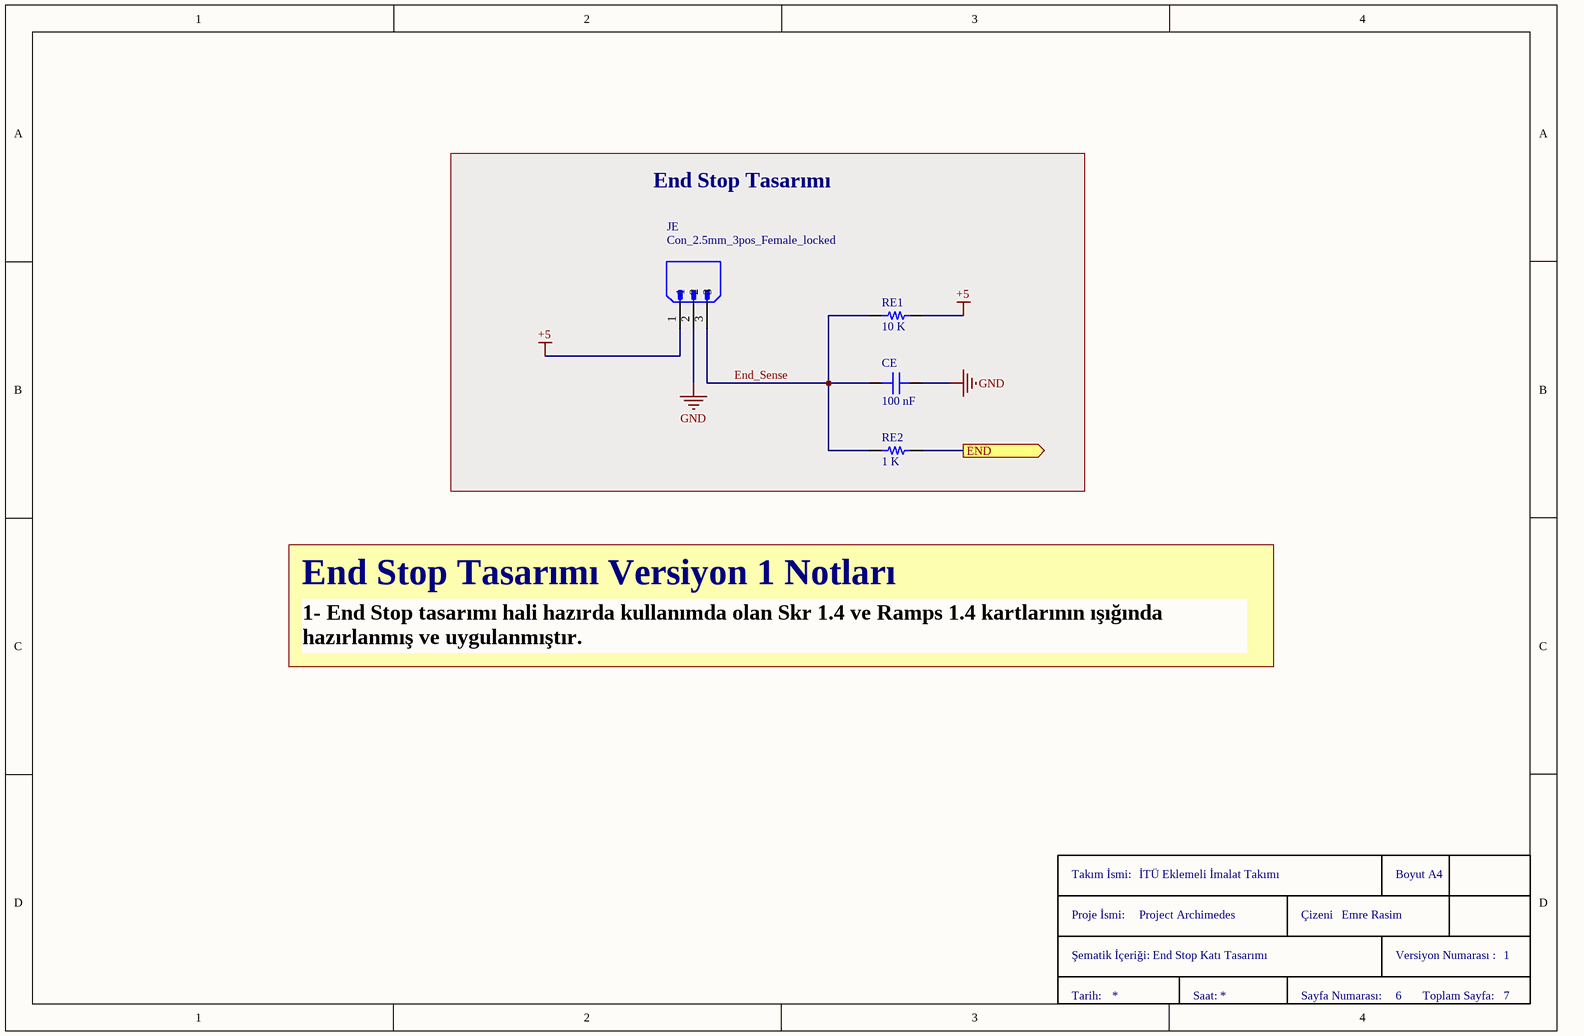
[diagram p6: Archimedes_Endstop_Kati.SchDoc]

### Parts
CE  100 nF  [CAP 0805/2012]
JE  Con_2.5mm_3pos_Female_locked  [Con_3lead_2.5mm_locked]
RE1  10 K  [RES 0805/2012]
RE2  1 K  [RES 0805/2012]
TitleBlock-A4  TitleBlock-A4  (value not drawn)  (graphical)

### Blocks framed on the sheet
End Stop Tasarımı: CE JE RE1 RE2

### Ports
END (out)

### Nets
+5: JE.1 RE1.2
GND: CE.2 JE.2
END: RE2.2 ; port END
End_Sense: CE.1 JE.3 RE1.1 RE2.1

### Channels
Archimedes_Endstop_Kati1: designators CE=CEA JE=JEA RE1=RE1A RE2=RE2A TitleBlock-A4=TitleBlock-A4A#3; ports END=END1
Archimedes_Endstop_Kati2: designators CE=CEB JE=JEB RE1=RE1B RE2=RE2B TitleBlock-A4=TitleBlock-A4B#3; ports END=END2
Archimedes_Endstop_Kati3: designators CE=CEC JE=JEC RE1=RE1C RE2=RE2C TitleBlock-A4=TitleBlock-A4C#2; ports END=END3

### Notes on the sheet
- End Stop Tasarımı Versiyon 1 Notları
- 1- End Stop tasarımı hali hazırda kullanımda olan Skr 1.4 ve Ramps 1.4 kartlarının ışığında hazırlanmış ve uygulanmıştır.
- (in symbol TitleBlock-A4) Takım İsmi:; Boyut A4; Proje İsmi:; Çizeni; Şematik İçeriği:; Versiyon Numarası :; Tarih:; Saat:; Sayfa Numarası:; Toplam Sayfa:

### Library data of the parts
CE = Capacitor 805: as CB3 on sheet Archimedes_Cevirici_Kati
JE = Con_2.5mm_3pos_Female_locked: 3 lead female locked connector for 3d printer limit switch; MP: B3B-XH-A(LF)(SN); Value: *; Availability: Unavailable; Package: None; Price: None
RE1 = Resistor 805: as RS4 on sheet Archimedes_Surucu_Kati
RE2 = Resistor 805: 1 K ohm Resistor  with 805 pack and %1 tolerance rating
TitleBlock-A4 = TitleBlock-A4: as TitleBlock-A4#1 on sheet Archimedes_Ana_Sayfa

## Sheet Archimedes_Surucu_Cift_Cikis.SchDoc: Archimedes_Surucu_Cift_Cikis_Tasarımı
size A4; SheetNumber: 8; SheetTotal: 8; Sematikicerigi: Step Motor Sürücü Katı Tasarımı(Çift Çıkış)
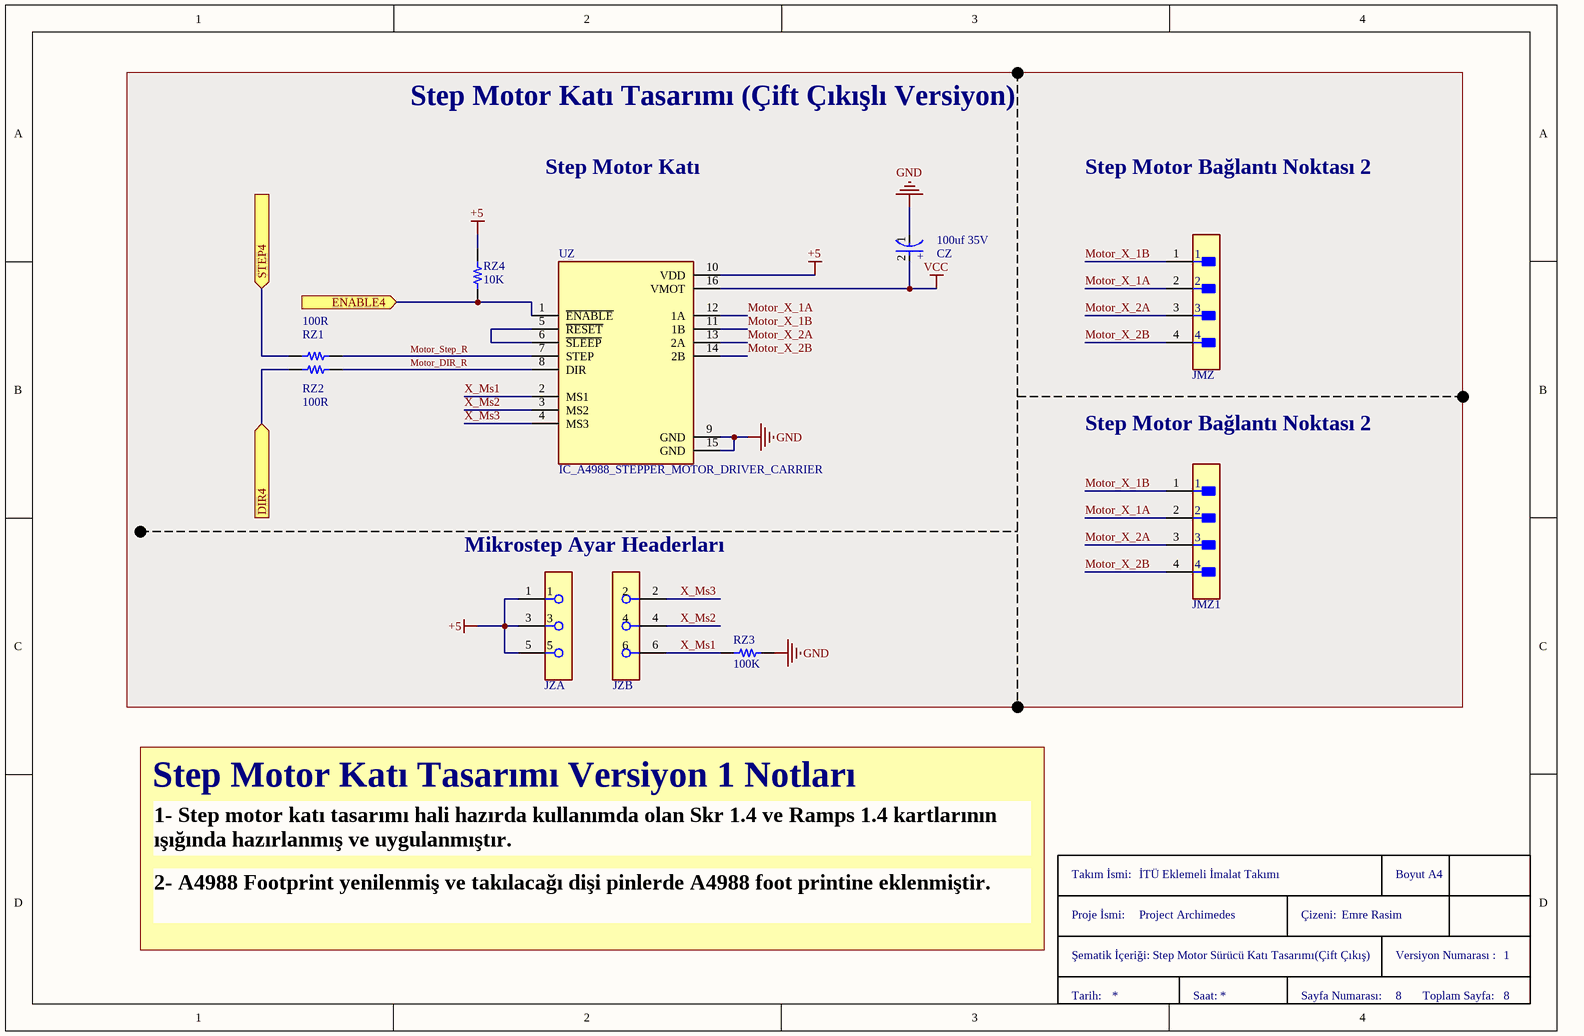
[diagram p7: Archimedes_Surucu_Cift_Cikis.SchDoc]

### Parts
(Parts that share a designator on the sheet are numbered #1, #2 ... from top to bottom, then left to right.)
CZ  100uf 35V  [C_Smd_D6.3_H_7.7_Electrolytic_Cap]
JMZ  2.5 mm locked  [CON_2.5MM_4_LEAD_180_LOCKED]  (value not drawn)
JMZ1  2.5 mm locked  [CON_2.5MM_4_LEAD_180_LOCKED]  (value not drawn)
JZ  Con_3*2_Male_Header  [Con_3*2_Male_header]  (value not drawn)  (parts A,B of 2)
RZ1  100R  [RES 0805/2012]
RZ2  100R  [RES 0805/2012]
RZ3  100K  [RES 0805/2012]
RZ4  10K  [RES 0805/2012]
TitleBlock-A4#5  TitleBlock-A4  (value not drawn)  (graphical)
UZ  IC_A4988_STEPPER_MOTOR_DRIVER_CARRIER  [IC_A4988_STEPPER_MOTOR_DRIVER_CARRIER]

### Blocks framed on the sheet
Step Motor Katı Tasarımı (Çift Çıkışlı Versiyon): CZ JMZ JMZ1 JZ RZ1-RZ4 UZ

### Ports
DIR4 (in), ENABLE4 (in), STEP4 (in)

### Nets
+5: JZ.1 JZ.3 JZ.5 RZ4.2 UZ.10(VDD)
GND: CZ.1(C) RZ3.2 UZ.9(GND) UZ.15(GND)
VCC: CZ.2(A) UZ.16(VMOT)
DIR4: RZ2.1 ; port DIR4
ENABLE4: RZ4.1 UZ.1(~{ENABLE}) ; port ENABLE4
Motor_DIR_R: RZ2.2 UZ.8(DIR)
Motor_Step_R: RZ1.2 UZ.7(STEP)
Motor_X_1A: JMZ.2 JMZ1.2 UZ.12(1A)
Motor_X_1B: JMZ.1 JMZ1.1 UZ.11(1B)
Motor_X_2A: JMZ.3 JMZ1.3 UZ.13(2A)
Motor_X_2B: JMZ.4 JMZ1.4 UZ.14(2B)
STEP4: RZ1.1 ; port STEP4
X_Ms1: JZ.6 RZ3.1 UZ.2(MS1)
X_Ms2: JZ.4 UZ.3(MS2)
X_Ms3: JZ.2 UZ.4(MS3)
NetUZ_5: UZ.5(~{RESET}) UZ.6(~{SLEEP})

### Notes on the sheet
- Step Motor Katı
- Step Motor Bağlantı Noktası 2
- (near JZ) Mikrostep Ayar Headerları
- Step Motor Katı Tasarımı Versiyon 1 Notları
- 1- Step motor katı tasarımı hali hazırda kullanımda olan Skr 1.4 ve Ramps 1.4 kartlarının ışığında hazırlanmış ve uygulanmıştır.
- 2- A4988 Footprint yenilenmiş ve takılacağı dişi pinlerde A4988 foot printine eklenmiştir.
- (in symbol C_smd_D6.3_H7.7) +
- (in symbol TitleBlock-A4) Takım İsmi:; Boyut A4; Proje İsmi:; Çizeni:; Şematik İçeriği:; Versiyon Numarası :; Tarih:; Saat:; Sayfa Numarası:; Toplam Sayfa:

### Library data of the parts
CZ = C_smd_D6.3_H7.7: as CS1 on sheet Archimedes_Surucu_Kati
JMZ JMZ1 = Con_2.5mm_4_lead_180_locked: 2.5 mm 4 lead locked connector
JZ = Con_3*2_Male_Header: 3*2 male header
RZ1 RZ2 = Resistor 805: as RS1 on sheet Archimedes_Surucu_Kati
RZ3 = Resistor 805: as RS3 on sheet Archimedes_Surucu_Kati
RZ4 = Resistor 805: as RS4 on sheet Archimedes_Surucu_Kati
TitleBlock-A4#5 = TitleBlock-A4: as TitleBlock-A4#1 on sheet Archimedes_Ana_Sayfa
UZ = IC_A4988_STEPPER_MOTOR_DRIVER_CARRIER: as US_ on sheet Archimedes_Surucu_Kati; Package: None; Availability: Unavailable; Value: *; MP: A4988_STEPPER_MOTOR_DRIVER_CARRIER; Price: None

## Nets that join several sheets
+5: Archimedes_Islemci_Katı (5 pins), Archimedes_Surucu_Kati1 (5 pins), Archimedes_Surucu_Kati2 (5 pins), Archimedes_Surucu_Kati3 (5 pins), Archimedes_Thermistor_Kati1 (RTA.2), Archimedes_Thermistor_Kati2 (RTB.2), Archimedes_Isil_Mosfet_Kati (UH.14), Archimedes_Cevirici_Kati (5 pins), Archimedes_Endstop_Kati1 (JEA.1 RE1A.2), Archimedes_Endstop_Kati2 (JEB.1 RE1B.2), Archimedes_Endstop_Kati3 (JEC.1 RE1C.2), Archimedes_Surucu_Cift_Cikis (5 pins)
GND: Archimedes_Islemci_Katı (11 pins), Archimedes_Surucu_Kati1 (CS1A.1 RS3A.2 US_A.9 US_A.15), Archimedes_Surucu_Kati2 (CS1B.1 RS3B.2 US_B.9 US_B.15), Archimedes_Surucu_Kati3 (CS1C.1 RS3C.2 US_C.9 US_C.15), Archimedes_Thermistor_Kati1 (CTA.1 JTA.2 VRTA.2), Archimedes_Thermistor_Kati2 (CTB.1 JTB.2 VRTB.2), Archimedes_Isil_Mosfet_Kati (9 pins), Archimedes_Cevirici_Kati (16 pins), Archimedes_Endstop_Kati1 (CEA.2 JEA.2), Archimedes_Endstop_Kati2 (CEB.2 JEB.2), Archimedes_Endstop_Kati3 (CEC.2 JEC.2), Archimedes_Surucu_Cift_Cikis (CZ.1 RZ3.2 UZ.9 UZ.15)
VCC: Archimedes_Surucu_Kati1 (CS1A.2 US_A.16), Archimedes_Surucu_Kati2 (CS1B.2 US_B.16), Archimedes_Surucu_Kati3 (CS1C.2 US_C.16), Archimedes_Isil_Mosfet_Kati (FH.2 FH1.2 RH7.2 RH8.2), Archimedes_Cevirici_Kati (7 pins), Archimedes_Surucu_Cift_Cikis (CZ.2 UZ.16)
DIR1: Archimedes_Islemci_Katı (MCU_Arduino_Mega_For_Archimedes.51), Archimedes_Surucu_Kati1 (RS2A.1)
DIR2: Archimedes_Islemci_Katı (MCU_Arduino_Mega_For_Archimedes.45), Archimedes_Surucu_Kati2 (RS2B.1)
DIR3: Archimedes_Islemci_Katı (MCU_Arduino_Mega_For_Archimedes.29), Archimedes_Surucu_Kati3 (RS2C.1)
DIR4: Archimedes_Islemci_Katı (MCU_Arduino_Mega_For_Archimedes.9), Archimedes_Surucu_Cift_Cikis (RZ2.1)
ENABLE1: Archimedes_Islemci_Katı (MCU_Arduino_Mega_For_Archimedes.19), Archimedes_Surucu_Kati1 (RS4A.1 US_A.1)
ENABLE2: Archimedes_Islemci_Katı (MCU_Arduino_Mega_For_Archimedes.50), Archimedes_Surucu_Kati2 (RS4B.1 US_B.1)
ENABLE3: Archimedes_Islemci_Katı (MCU_Arduino_Mega_For_Archimedes.44), Archimedes_Surucu_Kati3 (RS4C.1 US_C.1)
ENABLE4: Archimedes_Islemci_Katı (MCU_Arduino_Mega_For_Archimedes.5), Archimedes_Surucu_Cift_Cikis (RZ4.1 UZ.1)
END1: Archimedes_Islemci_Katı (MCU_Arduino_Mega_For_Archimedes.72), Archimedes_Endstop_Kati1 (RE2A.2)
END2: Archimedes_Islemci_Katı (MCU_Arduino_Mega_For_Archimedes.68), Archimedes_Endstop_Kati2 (RE2B.2)
END3: Archimedes_Islemci_Katı (MCU_Arduino_Mega_For_Archimedes.64), Archimedes_Endstop_Kati3 (RE2C.2)
HB: Archimedes_Islemci_Katı (MCU_Arduino_Mega_For_Archimedes.77), Archimedes_Isil_Mosfet_Kati (UH.2)
HE0: Archimedes_Islemci_Katı (MCU_Arduino_Mega_For_Archimedes.79), Archimedes_Isil_Mosfet_Kati (UH.5)
STEP1: Archimedes_Islemci_Katı (MCU_Arduino_Mega_For_Archimedes.52), Archimedes_Surucu_Kati1 (RS1A.1)
STEP2: Archimedes_Islemci_Katı (MCU_Arduino_Mega_For_Archimedes.46), Archimedes_Surucu_Kati2 (RS1B.1)
STEP3: Archimedes_Islemci_Katı (MCU_Arduino_Mega_For_Archimedes.27), Archimedes_Surucu_Kati3 (RS1C.1)
STEP4: Archimedes_Islemci_Katı (MCU_Arduino_Mega_For_Archimedes.7), Archimedes_Surucu_Cift_Cikis (RZ1.1)
THR1: Archimedes_Islemci_Katı (MCU_Arduino_Mega_For_Archimedes.39), Archimedes_Thermistor_Kati1 (CTA.2 JTA.1 RTA.1 VRTA.1)
THR2: Archimedes_Islemci_Katı (MCU_Arduino_Mega_For_Archimedes.38), Archimedes_Thermistor_Kati2 (CTB.2 JTB.1 RTB.1 VRTB.1)